# Altium schematic sheet Block_Diagram.SchDoc: Block Diagram
size B; Organization: Myomo; Address1: 137 PORTLAND STREET, 4TH FLOOR; Address2: BOSTON, MA 02114; Address3: USA; SheetNumber: 1
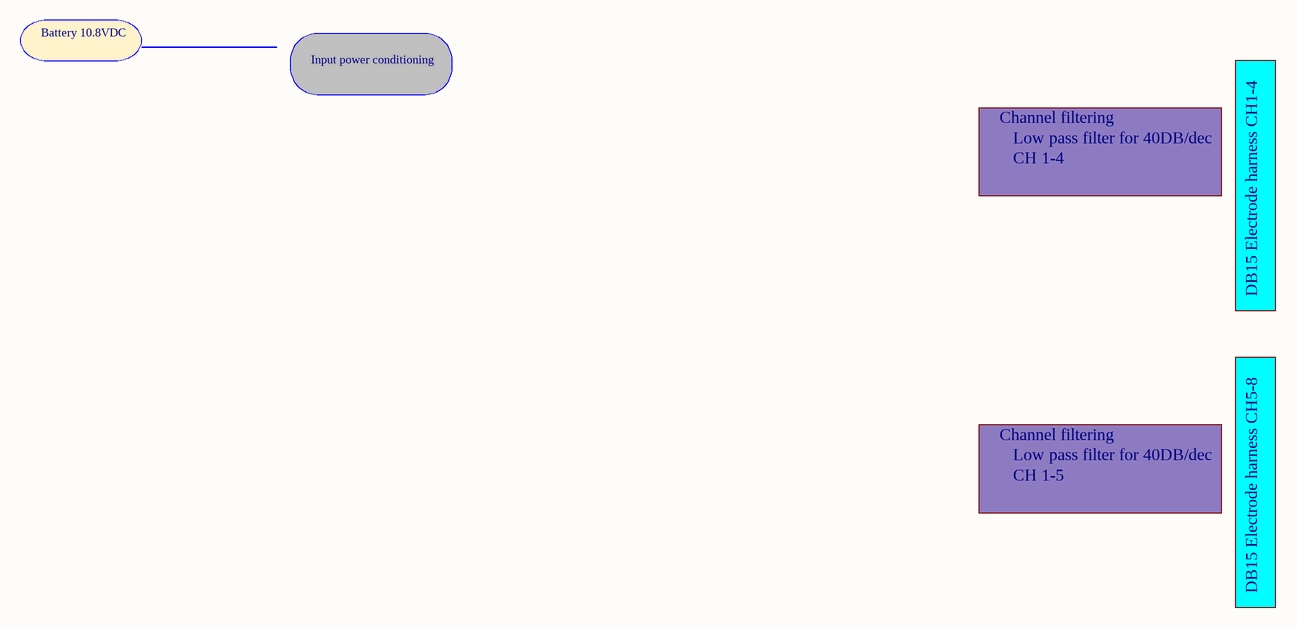
[diagram p0: Block_Diagram.SchDoc]

## Notes on the sheet
- Battery 10.8VDC
- Input power conditioning
- Channel filtering
- Low pass filter for 40DB/dec
- CH 1-4
- DB15 Electrode harness CH1-4
- CH 1-5
- DB15 Electrode harness CH5-8
- TITLE:
- NAME
- DATE
- PCA REVISION:
- PCA NAME:
- APPROVED BY:
- DESIGNED BY:
- PCA NUMBER:
- DATE:
- TIME:
- DOCUMENT SIZE:
- SHEET:
- OF
- B
- PROPRIETARY AND CONFIDENTIAL
  THIS DOCUMENT AND THE DATA CONTAINED HEREIN OR HEREWITH IS NOT TO BE REPRODUCED, USED, OR DISCLOSED, IN WHOLE OR IN PART, WITHOUT THE PERMISSION OF
  MYOMO, INC.